# Altium schematic sheet EST_MainV20_Input.SchDoc
size B
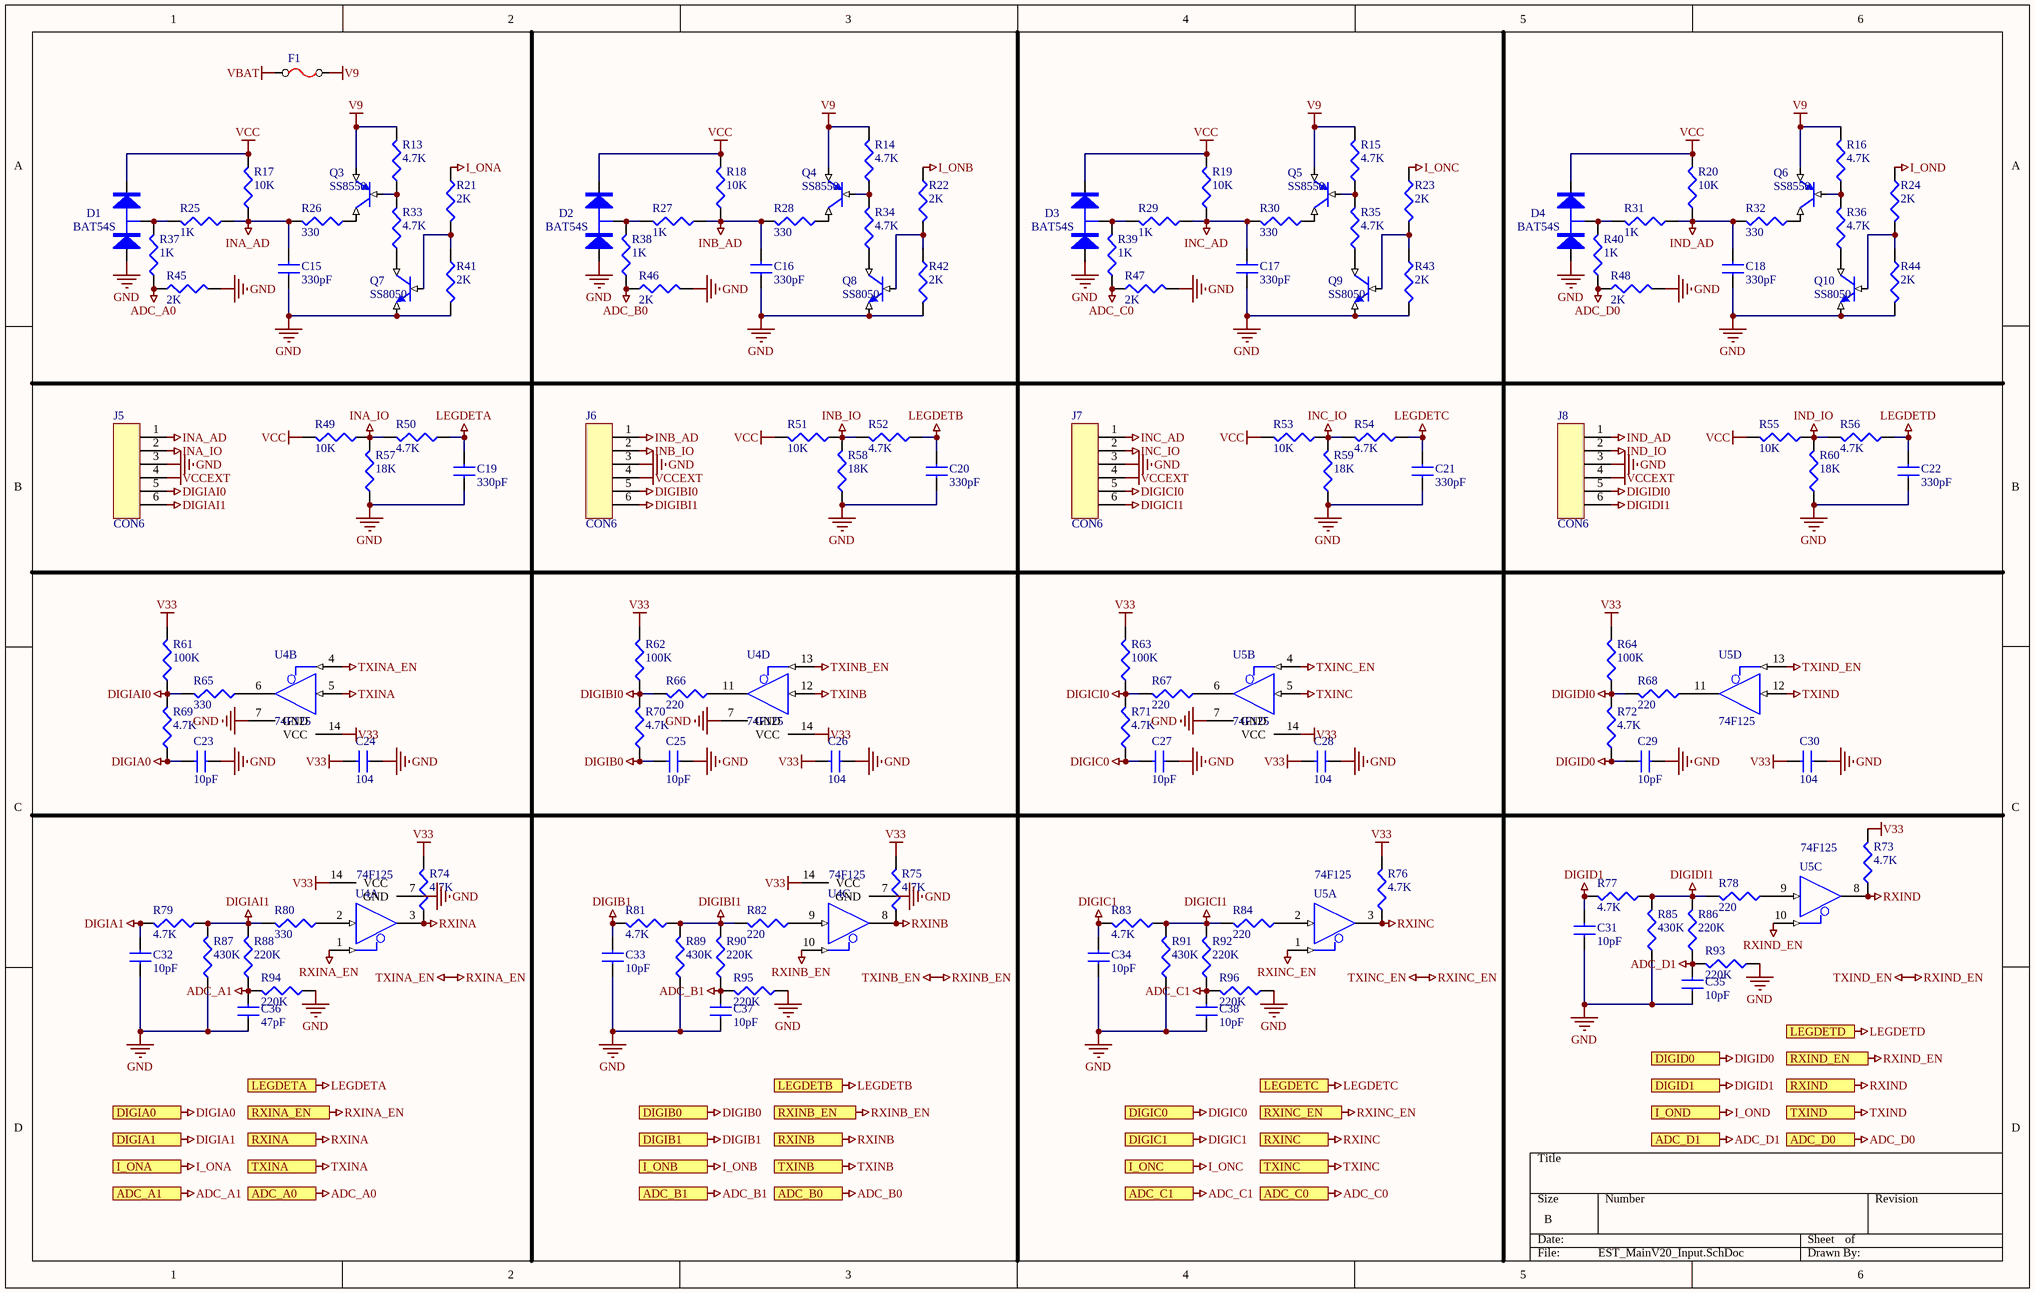
[diagram p0: EST_MainV20_Input.SchDoc]

## Parts
C15  330pF  [CAP_0603]
C16  330pF  [CAP_0603]
C17  330pF  [CAP_0603]
C18  330pF  [CAP_0603]
C19  330pF  [CAP_0603]
C20  330pF  [CAP_0603]
C21  330pF  [CAP_0603]
C22  330pF  [CAP_0603]
C23  10pF  [CAP_0603]
C24  104  [CAP_0603]
C25  10pF  [CAP_0603]
C26  104  [CAP_0603]
C27  10pF  [CAP_0603]
C28  104  [CAP_0603]
C29  10pF  [CAP_0603]
C30  104  [CAP_0603]
C31  10pF  [CAP_0603]
C32  10pF  [CAP_0603]
C33  10pF  [CAP_0603]
C34  10pF  [CAP_0603]
C35  10pF  [CAP_0603]
C36  47pF  [CAP_0603]
C37  10pF  [CAP_0603]
C38  10pF  [CAP_0603]
D1  BAT54S  [BAT54S]
D2  BAT54S  [BAT54S]
D3  BAT54S  [BAT54S]
D4  BAT54S  [BAT54S]
F1  FUSE  [1812]  (value not drawn)
J5  CON6  [Lego_RJ11]
J6  CON6  [Lego_RJ11]
J7  CON6  [Lego_RJ11]
J8  CON6  [Lego_RJ11]
Q3  SS8550  [8050SMD]
Q4  SS8550  [8050SMD]
Q5  SS8550  [8050SMD]
Q6  SS8550  [8050SMD]
Q7  SS8050  [8050SMD]
Q8  SS8050  [8050SMD]
Q9  SS8050  [8050SMD]
Q10  SS8050  [8050SMD]
R13  4.7K  [RES_0603]
R14  4.7K  [RES_0603]
R15  4.7K  [RES_0603]
R16  4.7K  [RES_0603]
R17  10K  [RES_0603]
R18  10K  [RES_0603]
R19  10K  [RES_0603]
R20  10K  [RES_0603]
R21  2K  [RES_0603]
R22  2K  [RES_0603]
R23  2K  [RES_0603]
R24  2K  [RES_0603]
R25  1K  [RES_0603]
R26  330  [RES_0603]
R27  1K  [RES_0603]
R28  330  [RES_0603]
R29  1K  [RES_0603]
R30  330  [RES_0603]
R31  1K  [RES_0603]
R32  330  [RES_0603]
R33  4.7K  [RES_0603]
R34  4.7K  [RES_0603]
R35  4.7K  [RES_0603]
R36  4.7K  [RES_0603]
R37  1K  [RES_0603]
R38  1K  [RES_0603]
R39  1K  [RES_0603]
R40  1K  [RES_0603]
R41  2K  [RES_0603]
R42  2K  [RES_0603]
R43  2K  [RES_0603]
R44  2K  [RES_0603]
R45  2K  [RES_0603]
R46  2K  [RES_0603]
R47  2K  [RES_0603]
R48  2K  [RES_0603]
R49  10K  [RES_0603]
R50  4.7K  [RES_0603]
R51  10K  [RES_0603]
R52  4.7K  [RES_0603]
R53  10K  [RES_0603]
R54  4.7K  [RES_0603]
R55  10K  [RES_0603]
R56  4.7K  [RES_0603]
R57  18K  [RES_0603]
R58  18K  [RES_0603]
R59  18K  [RES_0603]
R60  18K  [RES_0603]
R61  100K  [RES_0603]
R62  100K  [RES_0603]
R63  100K  [RES_0603]
R64  100K  [RES_0603]
R65  330  [RES_0603]
R66  220  [RES_0603]
R67  220  [RES_0603]
R68  220  [RES_0603]
R69  4.7K  [RES_0603]
R70  4.7K  [RES_0603]
R71  4.7K  [RES_0603]
R72  4.7K  [RES_0603]
R73  4.7K  [RES_0603]
R74  4.7K  [RES_0603]
R75  4.7K  [RES_0603]
R76  4.7K  [RES_0603]
R77  4.7K  [RES_0603]
R78  220  [RES_0603]
R79  4.7K  [RES_0603]
R80  330  [RES_0603]
R81  4.7K  [RES_0603]
R82  220  [RES_0603]
R83  4.7K  [RES_0603]
R84  220  [RES_0603]
R85  430K  [RES_0603]
R86  220K  [RES_0603]
R87  430K  [RES_0603]
R88  220K  [RES_0603]
R89  430K  [RES_0603]
R90  220K  [RES_0603]
R91  430K  [RES_0603]
R92  220K  [RES_0603]
R93  220K  [RES_0603]
R94  220K  [RES_0603]
R95  220K  [RES_0603]
R96  220K  [RES_0603]
U4  74F125  [TSSOP14]  (parts A,B,C,D of 4)
U5  74F125  [TSSOP14]  (parts A,B,C,D of 4)

## Ports
ADC_A0, ADC_A1, ADC_B0, ADC_B1, ADC_C0, ADC_C1, ADC_D0, ADC_D1, DIGIA0, DIGIA1, DIGIB0, DIGIB1, DIGIC0, DIGIC1, DIGID0, DIGID1, I_ONA, I_ONB, I_ONC, I_OND, LEGDETA, LEGDETB, LEGDETC, LEGDETD, RXINA, RXINA_EN, RXINB, RXINB_EN, RXINC, RXINC_EN, RXIND, RXIND_EN, TXINA, TXINB, TXINC, TXIND

## Nets
ADC_A0: R37.2(BOT) R45.2(BOT) ; port ADC_A0
ADC_A1: C36.2 R88.2(BOT) R94.1(TOP) ; port ADC_A1
ADC_B0: R38.2(BOT) R46.2(BOT) ; port ADC_B0
ADC_B1: C37.2 R90.2(BOT) R95.1(TOP) ; port ADC_B1
ADC_C0: R39.2(BOT) R47.2(BOT) ; port ADC_C0
ADC_C1: C38.2 R92.2(BOT) R96.1(TOP) ; port ADC_C1
ADC_D0: R40.2(BOT) R48.2(BOT) ; port ADC_D0
ADC_D1: C35.2 R86.2(BOT) R93.1(TOP) ; port ADC_D1
DIGIA0: C23.1 R69.2(BOT) ; port DIGIA0
DIGIA1: C32.2 R79.1(TOP) ; port DIGIA1
DIGIAI0: J5.5 R61.2(BOT) R65.1(TOP) R69.1(TOP)
DIGIAI1: J5.6 R79.2(BOT) R80.1(TOP) R87.1(TOP) R88.1(TOP)
DIGIB0: C25.1 R70.2(BOT) ; port DIGIB0
DIGIB1: C33.2 R81.1(TOP) ; port DIGIB1
DIGIBI0: J6.5 R62.2(BOT) R66.1(TOP) R70.1(TOP)
DIGIBI1: J6.6 R81.2(BOT) R82.1(TOP) R89.1(TOP) R90.1(TOP)
DIGIC0: C27.1 R71.2(BOT) ; port DIGIC0
DIGIC1: C34.2 R83.1(TOP) ; port DIGIC1
DIGICI0: J7.5 R63.2(BOT) R67.1(TOP) R71.1(TOP)
DIGICI1: J7.6 R83.2(BOT) R84.1(TOP) R91.1(TOP) R92.1(TOP)
DIGID0: C29.1 R72.2(BOT) ; port DIGID0
DIGID1: C31.2 R77.1(TOP) ; port DIGID1
DIGIDI0: J8.5 R64.2(BOT) R68.1(TOP) R72.1(TOP)
DIGIDI1: J8.6 R77.2(BOT) R78.1(TOP) R85.1(TOP) R86.1(TOP)
GND: C15.2 C16.2 C17.2 C18.2 C19.2 C20.2 C21.2 C22.2 C23.2 C24.2 C25.2 C26.2 C27.2 C28.2 C29.2 C30.2 C31.1 C32.1 C33.1 C34.1 C35.1 C36.1 C37.1 C38.1 D1.1(A) D2.1(A) D3.1(A) D4.1(A) J5.3 J6.3 J7.3 J8.3 Q7.1(E) Q8.1(E) Q9.1(E) Q10.1(E) R41.1(TOP) R42.1(TOP) R43.1(TOP) R44.1(TOP) R45.1(TOP) R46.1(TOP) R47.1(TOP) R48.1(TOP) R57.2(BOT) R58.2(BOT) R59.2(BOT) R60.2(BOT) R85.2(BOT) R87.2(BOT) R89.2(BOT) R91.2(BOT) R93.2(BOT) R94.2(BOT) R95.2(BOT) R96.2(BOT) U4.7(GND) U5.7(GND)
I_ONA: R21.2(BOT) ; port I_ONA
I_ONB: R22.2(BOT) ; port I_ONB
I_ONC: R23.2(BOT) ; port I_ONC
I_OND: R24.2(BOT) ; port I_OND
INA_AD: C15.1 J5.1 R17.2(BOT) R25.2(BOT) R26.1(TOP)
INA_IO: J5.2 R49.2(BOT) R50.1(TOP) R57.1(TOP)
INB_AD: C16.1 J6.1 R18.2(BOT) R27.2(BOT) R28.1(TOP)
INB_IO: J6.2 R51.2(BOT) R52.1(TOP) R58.1(TOP)
INC_AD: C17.1 J7.1 R19.2(BOT) R29.2(BOT) R30.1(TOP)
INC_IO: J7.2 R53.2(BOT) R54.1(TOP) R59.1(TOP)
IND_AD: C18.1 J8.1 R20.2(BOT) R31.2(BOT) R32.1(TOP)
IND_IO: J8.2 R55.2(BOT) R56.1(TOP) R60.1(TOP)
LEGDETA: C19.1 R50.2(BOT) ; port LEGDETA
LEGDETB: C20.1 R52.2(BOT) ; port LEGDETB
LEGDETC: C21.1 R54.2(BOT) ; port LEGDETC
LEGDETD: C22.1 R56.2(BOT) ; port LEGDETD
RXINA: R74.2(BOT) U4.3(Y) ; port RXINA
RXINA_EN: U4.1(~{G}) U4.4(~{G}) ; port RXINA_EN  [also labelled TXINA_EN]
RXINB: R75.2(BOT) U4.8(Y) ; port RXINB
RXINB_EN: U4.10(~{G}) U4.13(~{G}) ; port RXINB_EN  [also labelled TXINB_EN]
RXINC: R76.2(BOT) U5.3(Y) ; port RXINC
RXINC_EN: U5.1(~{G}) U5.4(~{G}) ; port RXINC_EN  [also labelled TXINC_EN]
RXIND: R73.2(BOT) U5.8(Y) ; port RXIND
RXIND_EN: U5.10(~{G}) U5.13(~{G}) ; port RXIND_EN  [also labelled TXIND_EN]
TXINA: U4.5(A) ; port TXINA
TXINB: U4.12(A) ; port TXINB
TXINC: U5.5(A) ; port TXINC
TXIND: U5.12(A) ; port TXIND
V9: F1.2 Q3.1(E) Q4.1(E) Q5.1(E) Q6.1(E) R13.1(TOP) R14.1(TOP) R15.1(TOP) R16.1(TOP)
V33: C24.1 C26.1 C28.1 C30.1 D1.3(K) D2.3(K) D3.3(K) D4.3(K) R17.1(TOP) R18.1(TOP) R19.1(TOP) R20.1(TOP) R49.1(TOP) R51.1(TOP) R53.1(TOP) R55.1(TOP) R61.1(TOP) R62.1(TOP) R63.1(TOP) R64.1(TOP) R73.1(TOP) R74.1(TOP) R75.1(TOP) R76.1(TOP) U4.14(VCC) U5.14(VCC)  [also labelled VCC]
VBAT: F1.1
VCCEXT: J5.4 J6.4 J7.4 J8.4
NetD1_2: D1.2(C) R25.1(TOP) R37.1(TOP)
NetD2_2: D2.2(C) R27.1(TOP) R38.1(TOP)
NetD3_2: D3.2(C) R29.1(TOP) R39.1(TOP)
NetD4_2: D4.2(C) R31.1(TOP) R40.1(TOP)
NetQ3_2: Q3.2(B) R13.2(BOT) R33.1(TOP)
NetQ3_3: Q3.3(C) R26.2(BOT)
NetQ4_2: Q4.2(B) R14.2(BOT) R34.1(TOP)
NetQ4_3: Q4.3(C) R28.2(BOT)
NetQ5_2: Q5.2(B) R15.2(BOT) R35.1(TOP)
NetQ5_3: Q5.3(C) R30.2(BOT)
NetQ6_2: Q6.2(B) R16.2(BOT) R36.1(TOP)
NetQ6_3: Q6.3(C) R32.2(BOT)
NetQ7_2: Q7.2(B) R21.1(TOP) R41.2(BOT)
NetQ7_3: Q7.3(C) R33.2(BOT)
NetQ8_2: Q8.2(B) R22.1(TOP) R42.2(BOT)
NetQ8_3: Q8.3(C) R34.2(BOT)
NetQ9_2: Q9.2(B) R23.1(TOP) R43.2(BOT)
NetQ9_3: Q9.3(C) R35.2(BOT)
NetQ10_2: Q10.2(B) R24.1(TOP) R44.2(BOT)
NetQ10_3: Q10.3(C) R36.2(BOT)
NetR65_2: R65.2(BOT) U4.6(Y)
NetR66_2: R66.2(BOT) U4.11(Y)
NetR67_2: R67.2(BOT) U5.6(Y)
NetR68_2: R68.2(BOT) U5.11(Y)
NetR78_2: R78.2(BOT) U5.9(A)
NetR80_2: R80.2(BOT) U4.2(A)
NetR82_2: R82.2(BOT) U4.9(A)
NetR84_2: R84.2(BOT) U5.2(A)

## Library data of the parts
C15-C38 = CAP: Capacitor
D1-D4 = BANQIAO-A: DIODE BRIDGE
Q3-Q6 = PNP: triode
Q7-Q10 = NPN: triode
R13-R96 = RES: Resistor
U4 U5 = 74F125: Quad Bus Buffer Gate with 3-State Output